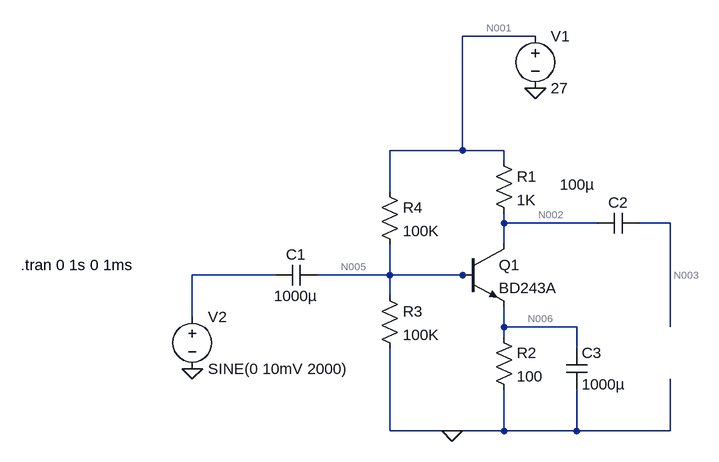
[diagram p0: schematic Common Emitter with 2N2222-Ver 2.asc]
Common Emitter with 2N2222-Ver 2.asc, the LTspice schematic file:
Version 4
SHEET 1 880 680
WIRE 272 -256 160 -256
WIRE 160 -80 160 -256
WIRE 160 -80 48 -80
WIRE 224 -80 160 -80
WIRE 224 -64 224 -80
WIRE 48 -16 48 -80
WIRE 224 32 224 16
WIRE 368 32 224 32
WIRE 480 32 432 32
WIRE 224 64 224 32
WIRE -128 112 -256 112
WIRE 48 112 48 64
WIRE 48 112 -64 112
WIRE 160 112 48 112
WIRE 176 112 160 112
WIRE 48 144 48 112
WIRE -256 176 -256 112
WIRE 224 192 224 160
WIRE 336 192 224 192
WIRE 480 192 480 32
WIRE 224 208 224 192
WIRE 336 224 336 192
WIRE 48 352 48 224
WIRE 144 352 48 352
WIRE 224 352 224 288
WIRE 224 352 144 352
WIRE 336 352 336 288
WIRE 336 352 224 352
WIRE 480 352 480 272
WIRE 480 352 336 352
FLAG 272 -176 0
FLAG 144 352 0
FLAG -256 256 0
SYMBOL npn 160 64 R0
SYMATTR InstName Q1
SYMATTR Value BD243A
SYMBOL voltage 272 -272 R0
WINDOW 123 0 0 Left 2
WINDOW 39 0 0 Left 2
SYMATTR InstName V1
SYMATTR Value 27
SYMBOL res 32 -32 R0
SYMATTR InstName R4
SYMATTR Value 100K
SYMBOL res 32 128 R0
SYMATTR InstName R3
SYMATTR Value 100K
SYMBOL res 208 192 R0
SYMATTR InstName R2
SYMATTR Value 100
SYMBOL cap 320 224 R0
SYMATTR InstName C3
SYMATTR Value 1000µ
SYMBOL cap 432 16 R90
WINDOW 0 0 32 VBottom 2
WINDOW 3 -59 95 VTop 2
SYMATTR InstName C2
SYMATTR Value 100µ
SYMBOL voltage -256 160 R0
WINDOW 123 0 0 Left 2
WINDOW 39 0 0 Left 2
SYMATTR InstName V2
SYMATTR Value SINE(0 10mV 2000)
SYMBOL cap -64 96 R90
WINDOW 0 0 32 VBottom 2
WINDOW 3 32 32 VTop 2
SYMATTR InstName C1
SYMATTR Value 1000µ
SYMBOL res 208 -80 R0
SYMATTR InstName R1
SYMATTR Value 1K
TEXT -520 96 Left 2 !.tran 0 1s 0 1ms

The netlist it stands for:
* Common Emitter with 2N2222-Ver 2.asc
Q1 N002 N005 N006 0 BD243A
V1 N001 0 27
R4 N001 N005 100K
R3 N005 0 100K
R2 N006 0 100
C3 N006 0 1000µ
C2 N003 N002 100µ
V2 N004 0 SINE(0 10mV 2000)
C1 N005 N004 1000µ
R1 N001 N002 1K
.model NPN NPN
.model PNP PNP
.lib standard.bjt
.tran 0 1s 0 1ms
.backanno
.end

* Results of the author's LTspice run, read from the files saved beside the schematic
* Operating Point, zero values left out:
*   V(n002) = 7.524 V
*   V(n005) = 2.612 V
*   V(n006) = 1.969 V
*   V(n001) = 27 V
*   V(n003) = 752.3 µV
*   Ic(Q1) = 19.48 mA
*   Ib(Q1) = 217.8 µA
*   Ie(Q1) = -19.69 mA
*   I(R1) = 19.48 mA
*   I(R2) = 19.69 mA
*   I(R3) = 26.12 µA
*   I(R4) = 243.9 µA
*   I(V1) = -19.72 mA
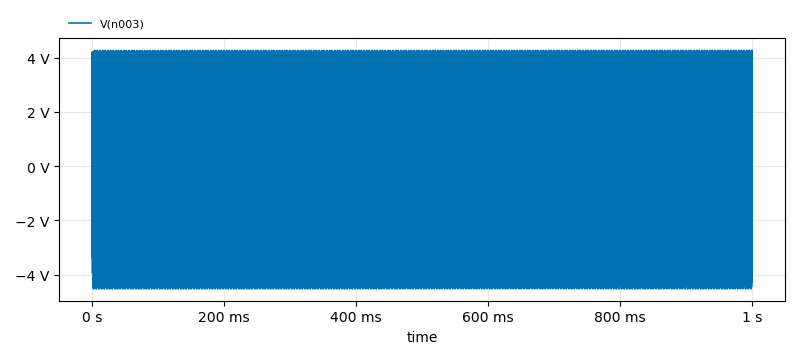
[diagram p1: Transient Analysis of Common Emitter with 2N2222-Ver 2.asc, plotted from the saved traces]
* Transient Analysis, 1 run:
*   V(n003): min -4.532 V, max 4.267 V, average -18.59 mV, rms 3.111 V, last 15.25 mV